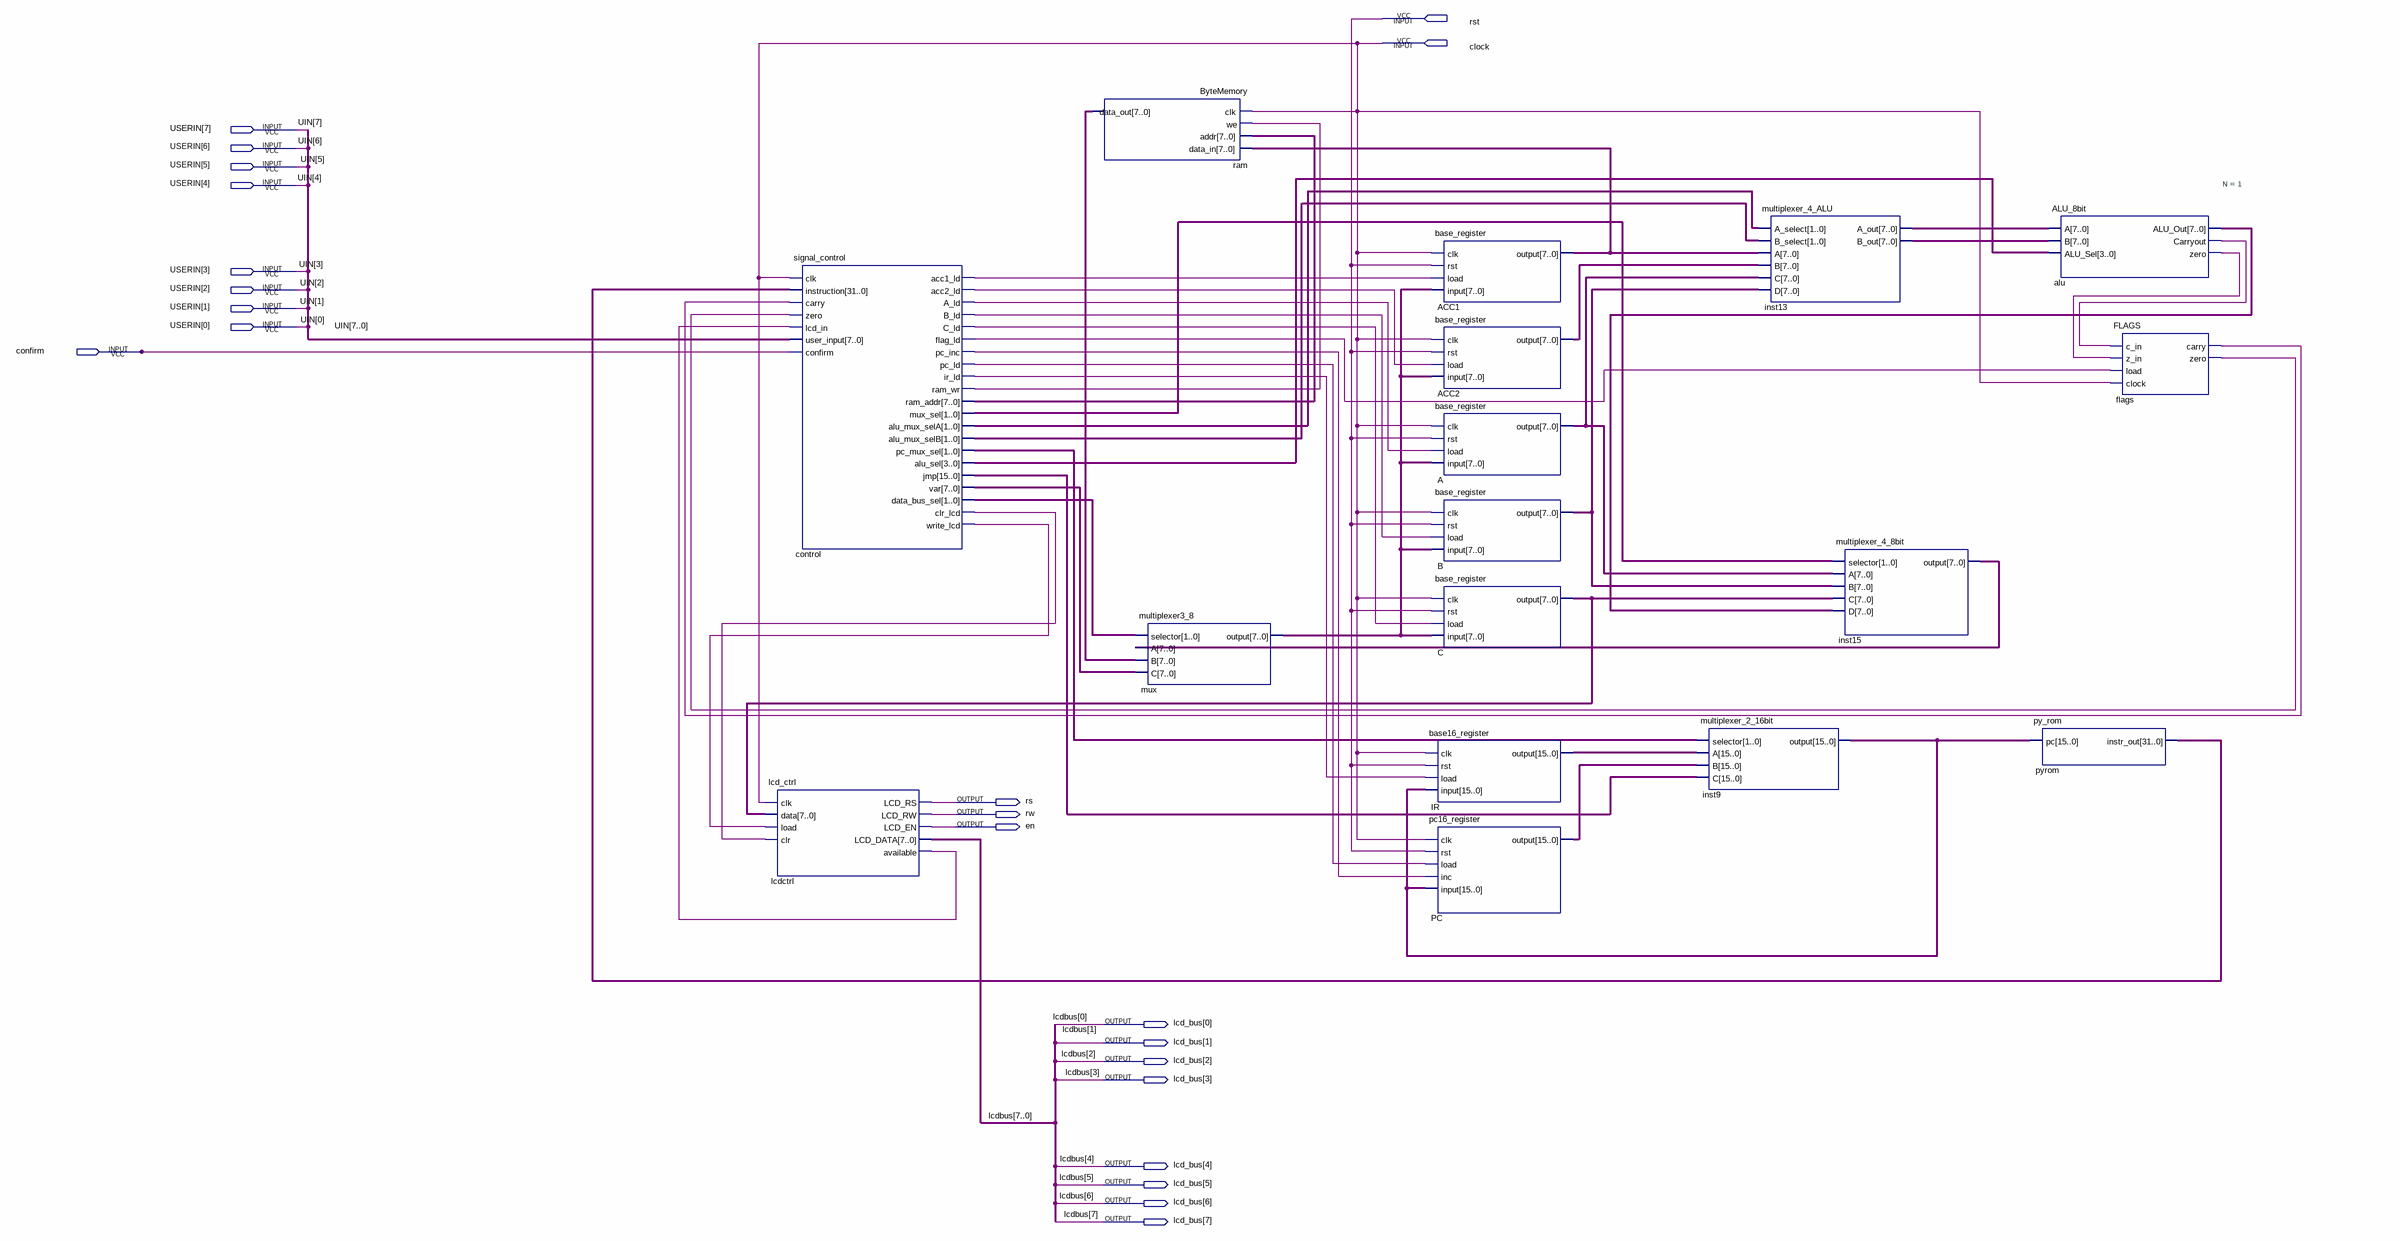
[diagram p0: schematic sheet]
// Quartus schematic 8bitCPU.bdf as structural Verilog: 17 symbols, 22 pins
module \8bitCPU  (
  input  rst,
  input  clock,
  input  [7:0] USERIN,
  input  confirm,
  output rs,
  output rw,
  output en,
  output [7:0] lcd_bus
);

  wire alu_carryout, alu_zero, control_a_ld, control_acc1_ld, control_acc2_ld, control_b_ld, control_c_ld,
       control_clr_lcd, control_flag_ld, control_ir_ld, control_pc_inc, control_pc_ld, control_ram_wr,
       control_write_lcd, flags_carry, flags_zero, lcdctrl_available;
  wire [1:0] control_alu_mux_sela, control_alu_mux_selb, control_data_bus_sel, control_mux_sel,
       control_pc_mux_sel;
  wire [3:0] control_alu_sel;
  wire [7:0] A_output, ACC1_output, ACC2_output, alu_alu_out, B_output, C_output, control_ram_addr,
       control_var, inst13_a_out, inst13_b_out, inst15_output, mux_output, ram_data_out;
  wire [15:0] control_jmp, inst9_output, IR_output, PC_output;
  wire [31:0] pyrom_instr_out;

  lcd_ctrl lcdctrl (
    .clk(clock), .data(C_output), .load(control_write_lcd), .clr(control_clr_lcd), .LCD_RS(rs), .LCD_RW(rw),
    .LCD_EN(en), .LCD_DATA(lcd_bus), .available(lcdctrl_available));
  signal_control control (
    .clk(clock), .instruction(pyrom_instr_out), .carry(flags_carry), .zero(flags_zero),
    .lcd_in(lcdctrl_available), .user_input(USERIN), .confirm(confirm), .acc1_ld(control_acc1_ld),
    .acc2_ld(control_acc2_ld), .A_ld(control_a_ld), .B_ld(control_b_ld), .C_ld(control_c_ld),
    .flag_ld(control_flag_ld), .pc_inc(control_pc_inc), .pc_ld(control_pc_ld), .ir_ld(control_ir_ld),
    .ram_wr(control_ram_wr), .ram_addr(control_ram_addr), .mux_sel(control_mux_sel),
    .alu_mux_selA(control_alu_mux_sela), .alu_mux_selB(control_alu_mux_selb),
    .pc_mux_sel(control_pc_mux_sel), .alu_sel(control_alu_sel), .jmp(control_jmp), .\var (control_var),
    .data_bus_sel(control_data_bus_sel), .clr_lcd(control_clr_lcd), .write_lcd(control_write_lcd));
  ByteMemory ram (
    .clk(clock), .we(control_ram_wr), .addr(control_ram_addr), .data_in(ACC1_output), .data_out(ram_data_out));
  multiplexer3_8 mux (
    .selector(control_data_bus_sel), .A(inst15_output), .B(ram_data_out), .C(control_var),
    .\output (mux_output));
  base16_register IR (.clk(clock), .rst(rst), .load(control_ir_ld), .\input (inst9_output), .\output (IR_output));
  pc16_register PC (
    .clk(clock), .rst(rst), .load(control_pc_ld), .inc(control_pc_inc), .\input (inst9_output),
    .\output (PC_output));
  base_register ACC1 (.clk(clock), .rst(rst), .load(control_acc1_ld), .\input (mux_output), .\output (ACC1_output));
  base_register ACC2 (.clk(clock), .rst(rst), .load(control_acc2_ld), .\input (mux_output), .\output (ACC2_output));
  base_register A (.clk(clock), .rst(rst), .load(control_a_ld), .\input (mux_output), .\output (A_output));
  base_register B (.clk(clock), .rst(rst), .load(control_b_ld), .\input (mux_output), .\output (B_output));
  base_register C (.clk(clock), .rst(rst), .load(control_c_ld), .\input (mux_output), .\output (C_output));
  multiplexer_2_16bit inst9 (
    .selector(control_pc_mux_sel), .A(IR_output), .B(PC_output), .C(control_jmp), .\output (inst9_output));
  multiplexer_4_ALU inst13 (
    .A_select(control_alu_mux_sela), .B_select(control_alu_mux_selb), .A(ACC1_output), .B(ACC2_output),
    .C(A_output), .D(B_output), .A_out(inst13_a_out), .B_out(inst13_b_out));
  multiplexer_4_8bit inst15 (
    .selector(control_mux_sel), .A(A_output), .B(B_output), .C(C_output), .D(alu_alu_out),
    .\output (inst15_output));
  ALU_8bit #(.N(1)) alu (
    .A(inst13_a_out), .B(inst13_b_out), .ALU_Sel(control_alu_sel), .ALU_Out(alu_alu_out),
    .Carryout(alu_carryout), .zero(alu_zero));
  py_rom pyrom (.pc(inst9_output), .instr_out(pyrom_instr_out));
  FLAGS flags (
    .c_in(alu_carryout), .z_in(alu_zero), .load(control_flag_ld), .clock(clock), .carry(flags_carry),
    .zero(flags_zero));

  // Other names for the same wires on the sheet: lcdbus[7:0] = lcd_bus; UIN[7:0] = USERIN
endmodule
